# Altium schematic sheet 05_Notes.SchDoc
size 246 x 182 mm; Page Create Date: March  8, 1995; Page Number: 5; Page Size: A; Reviewer: Default; Page Count: 5; Comment: TaoLin_DesignName; Designer: Dennis; Page Name: 05_Notes; RevCode: 1.0; DsnPath: H:\PCB\2026\狼王傻波一\20260204_V0_ELRS-RX\ELRS-RX-MODULE-V11\ELRS-RX-MODULE-V11-20260127.DSN; SchematicName: SCHEMATIC1; PageName: 05_Notes; PageSize: A; TopSchematic: True
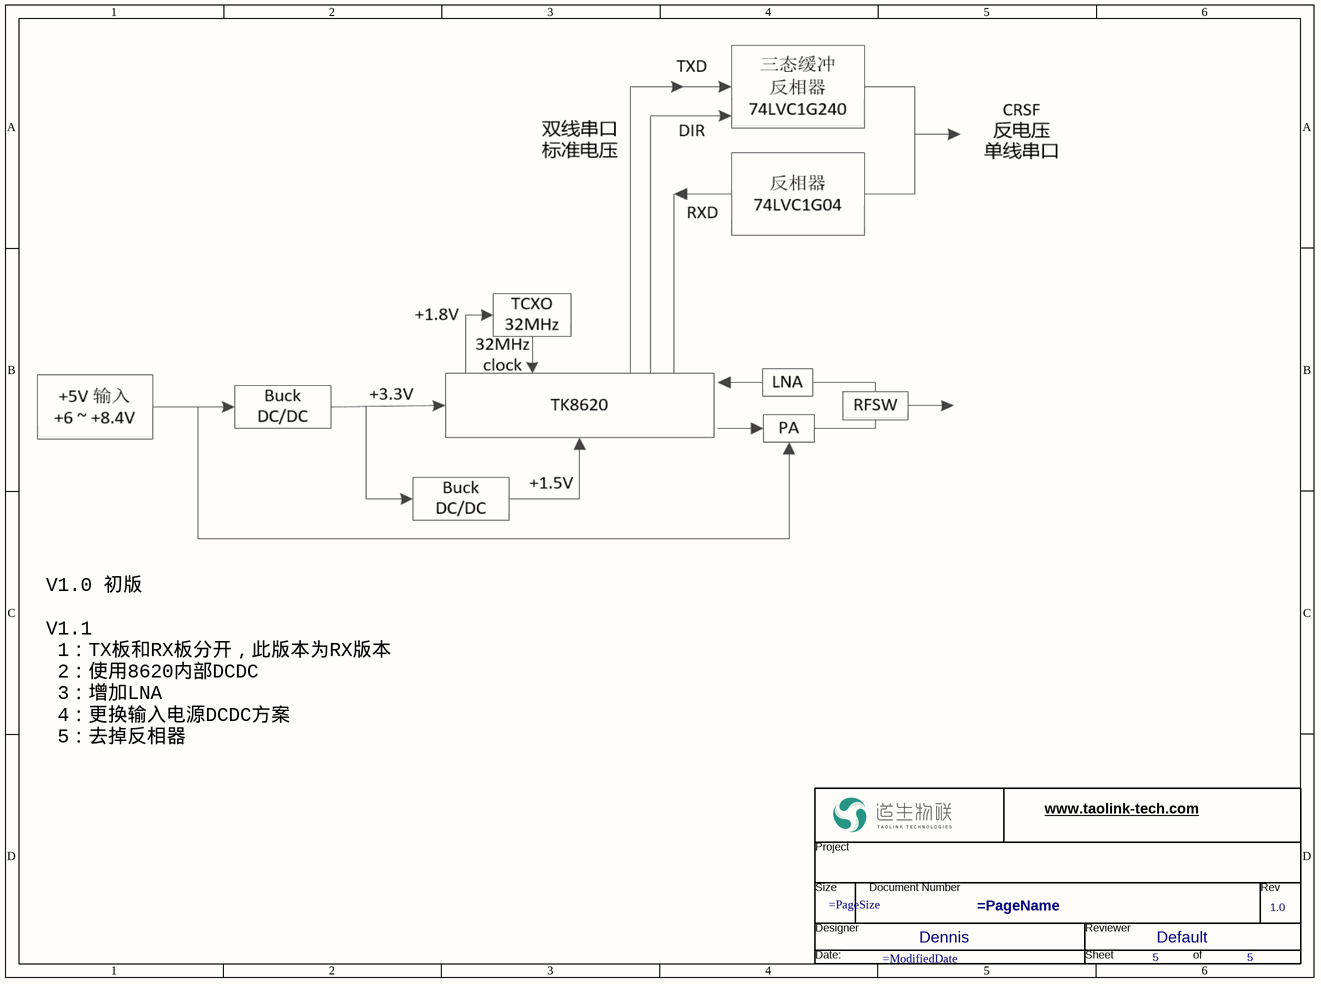
[diagram p0: 05_Notes.SchDoc]

## Parts
*  RevCode: 1.0  Designer: Dennis  Reviewer: Default  Page Number: 5  (hidden comment: TaoLin_DesignName)  (graphical)

## Notes on the sheet
- V1.0 初版
  V1.1
  1：TX板和RX板分开，此版本为RX版本
  2：使用8620内部DCDC
  3：增加LNA
  4：更换输入电源DCDC方案
  5：去掉反相器
- (in symbol TaoLin_DesignName) www.taolink-tech.com; Project; Size; Document Number; Rev; Designer; Reviewer; Date:; Sheet; of

## Library data of the parts
* = TaoLin_DesignName: Page Create Date: March  8, 1995; Page Size: =PageSize; Page Name: =PageName; Page Count: 5; Page Modify Date: =ModifiedDate